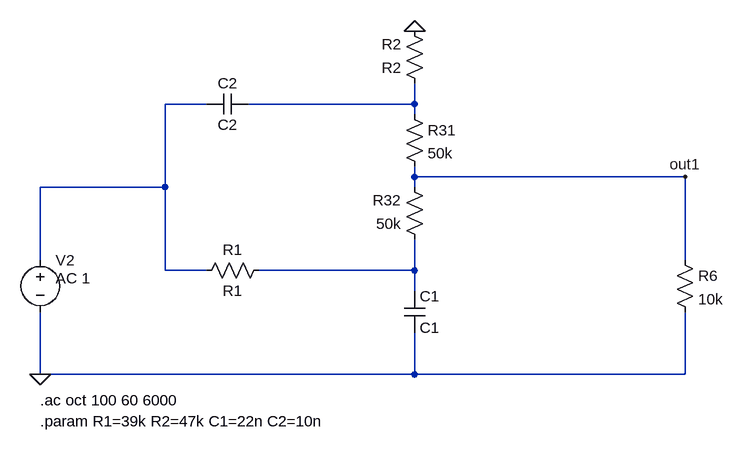
[diagram p0: schematic big_muff_tone_lowmod.asc]
big_muff_tone_lowmod.asc, the LTspice schematic file:
Version 4
SHEET 1 1328 680
WIRE -64 -256 -128 -256
WIRE 256 -256 256 -288
WIRE 256 -256 0 -256
WIRE 256 -240 256 -256
WIRE 256 -144 256 -160
WIRE 672 -144 256 -144
WIRE -128 -128 -128 -256
WIRE -128 -128 -320 -128
WIRE 256 -128 256 -144
WIRE -320 -16 -320 -128
WIRE 672 -16 672 -144
WIRE -128 0 -128 -128
WIRE -64 0 -128 0
WIRE 256 0 256 -48
WIRE 256 0 16 0
WIRE 256 32 256 0
WIRE -320 160 -320 64
WIRE 256 160 256 96
WIRE 256 160 -320 160
WIRE 672 160 672 64
WIRE 672 160 256 160
FLAG 672 -144 out1
FLAG 256 -368 0
FLAG -320 160 0
SYMBOL voltage -320 -32 R0
WINDOW 3 24 44 Left 2
WINDOW 123 24 44 Left 2
WINDOW 39 0 0 Left 0
SYMATTR Value ""
SYMATTR Value2 AC 1
SYMATTR InstName V2
SYMBOL res 656 -32 R0
SYMATTR InstName R6
SYMATTR Value 10k
SYMBOL res 272 -32 R180
WINDOW 0 36 76 Left 2
WINDOW 3 36 40 Left 2
SYMATTR InstName R32
SYMATTR Value 50k
SYMBOL res 240 -256 R0
SYMATTR InstName R31
SYMATTR Value 50k
SYMBOL res 32 -16 R90
WINDOW 0 0 56 VBottom 2
WINDOW 3 32 56 VTop 2
SYMATTR InstName R1
SYMATTR Value R1
SYMBOL res 272 -272 R180
WINDOW 0 36 76 Left 2
WINDOW 3 36 40 Left 2
SYMATTR InstName R2
SYMATTR Value R2
SYMBOL cap 240 32 R0
SYMATTR InstName C1
SYMATTR Value C1
SYMBOL cap 0 -272 R90
WINDOW 0 0 32 VBottom 2
WINDOW 3 32 32 VTop 2
SYMATTR InstName C2
SYMATTR Value C2
TEXT -320 200 Left 2 !.ac oct 100 60 6000
TEXT -320 232 Left 2 !.param R1=39k R2=47k C1=22n C2=10n

The netlist it stands for:
* big_muff_tone_lowmod.asc
V2 N001 0 AC 1
R6 out1 0 10k
R32 N003 out1 50k
R31 N002 out1 50k
R1 N003 N001 R1
R2 N002 0 R2
C1 N003 0 C1
C2 N002 N001 C2
.ac oct 100 60 6000
.param R1=39k R2=47k C1=22n C2=10n
.backanno
.end